# EasyEDA Pro project PM3510-AS5147P.epro

# Schematic AS5147P
Board Name: PM3510-AS5147P; Create Date: 2025-03-08; Page Name: P1; Project Name: Motor_Encoder; Schematic Name: AS5147P; Update Date: 2025-03-09
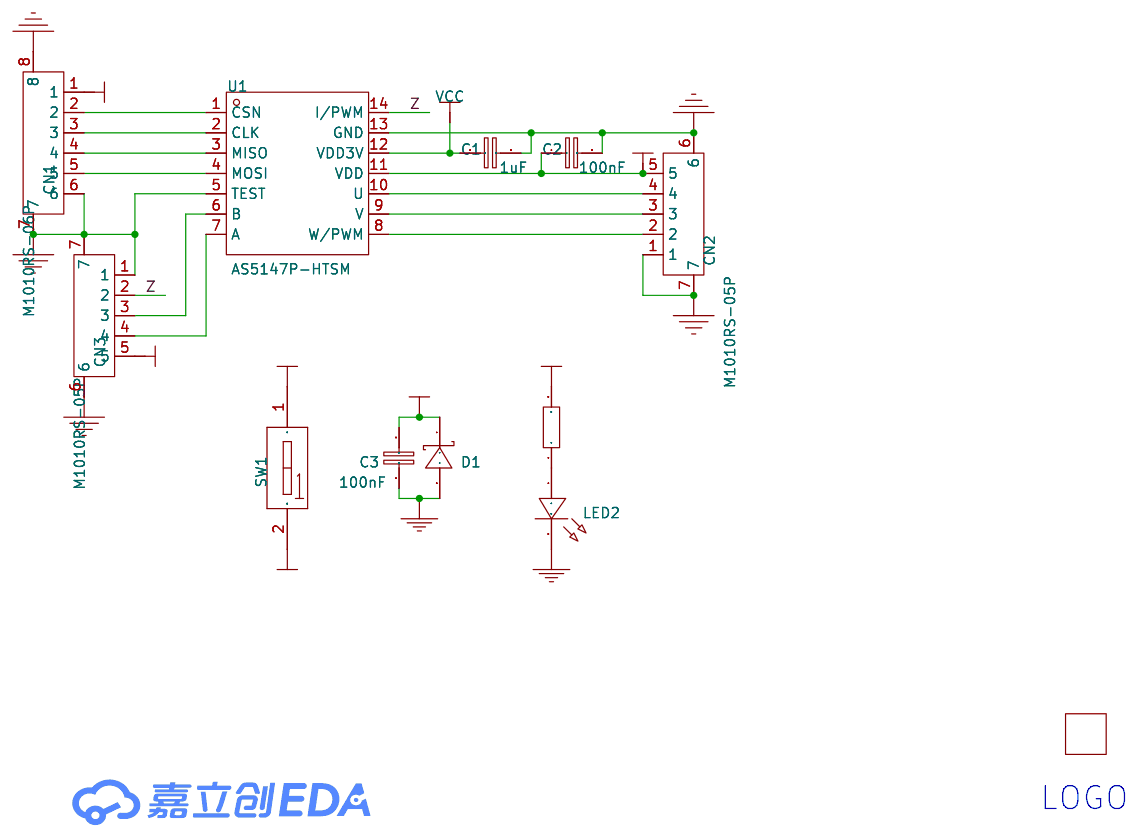
[diagram p0: schematic sheet]

## Parts
C1  1uF  [C0603]
C2  100nF  [C0603]
C3  100nF  [C0603]
CN1  M1010RS-06P  [CONN-SMD_M1010RS-06P]
CN2  M1010RS-05P  [CONN-SMD_M1010RS-05P]
CN3  M1010RS-05P  [CONN-SMD_M1010RS-05P]
D1  SMFJ5.0A  [SOD-123_L2.8-W1.8-LS3.7-RD]
H1  MoonGrt  [MoonGrt]  (no BOM)
LED2  -  [LED0603]
R2  1kΩ  [R0603]
SW1  DSHP01TSGET  [SW-SMD_DSHP01TSGET]
U1  AS5147P-HTSM  [TSSOP-14_L5.0-W4.4-P0.65-LS6.5-BL]

## Library data of the parts
C1 = CL10A105KB8NNNC: 容值:1uF;精度:±10%;额定电压:50V;材质(温度系数):X5R;; LCSC Part Name: 1uF ±10% 50V; Supplier Part: C15849; Manufacturer: SAMSUNG(三星); Supplier Footprint: 0603; JLCPCB Part Class: Basic Part; Datasheet: https://atta.szlcsc.com/upload/public/pdf/source/20160218/1457707763339.pdf; Supplier: LCSC; Tolerance: ±10%; Voltage Rated: 50V; Temperature Coefficient: X5R
C2 C3 = CC0603KRX7R9BB104: 容值:100nF;精度:±10%;额定电压:50V;材质(温度系数):X7R;; LCSC Part Name: 100nF ±10% 50V; Supplier Part: C14663; Manufacturer: YAGEO(国巨); Supplier Footprint: 0603; JLCPCB Part Class: Basic Part; Datasheet: https://atta.szlcsc.com/upload/public/pdf/source/20180910/C282072_33301C7F631E79921B82A8DAC6BCC5B3.pdf; Supplier: LCSC; Tolerance: ±10%; Voltage Rated: 50V; Temperature Coefficient: X7R
CN1 = M1010RS-06P: 插针结构:1x6P;间距:1mm;安装方式:卧贴;参考系列:-;总PIN数:6P;排数:1;每排PIN数:6;行距:-;额定电流:1A;工作温度范围:-25℃~+85℃;; LCSC Part Name: 1x6P 间距:1mm 卧贴; Supplier Part: C541848; Manufacturer: XFCN(兴飞); Supplier Footprint: SMD,P=1mm,卧贴; JLCPCB Part Class: Extended Part; Datasheet: https://atta.szlcsc.com/upload/public/pdf/source/20200518/C541847_4FBBB7CE1CCFE042AF6DD43CBAA42E89.pdf; Supplier: LCSC; Pins Structure: 1x6P; Pitch: 1mm; Mounting Style: 卧贴; Number of Pins: 6P; Number of Rows: 1; Number of PINs Per Row: 6; Current Rating (Max): 1A; Operating Temperature Range: -25℃~+85℃
CN2 CN3 = M1010RS-05P: 插针结构:1x5P;间距:1mm;安装方式:卧贴;参考系列:-;总PIN数:5P;排数:1;每排PIN数:5;行距:-;额定电流:1A;工作温度范围:-25℃~+85℃;; LCSC Part Name: 1x5P 间距:1mm 卧贴; Supplier Part: C541847; Manufacturer: XFCN(兴飞); Supplier Footprint: SMD,P=1mm,卧贴; JLCPCB Part Class: Extended Part; Datasheet: https://atta.szlcsc.com/upload/public/pdf/source/20200518/C541847_4FBBB7CE1CCFE042AF6DD43CBAA42E89.pdf; Supplier: LCSC; Pins Structure: 1x5P; Pitch: 1mm; Mounting Style: 卧贴; Number of Pins: 5P; Number of Rows: 1; Number of PINs Per Row: 5; Current Rating (Max): 1A; Operating Temperature Range: -25℃~+85℃
D1 = SMFJ5.0A_C61216: 反向截止电压(Vrwm):5V;最大钳位电压:9.2V;峰值脉冲电流(Ipp)@10/1000us:21.7A;击穿电压:6.4V;; Supplier Part: C61216; Manufacturer: RUILON(瑞隆源); Supplier Footprint: SOD-123; JLCPCB Part Class: Extended Part; Datasheet: https://atta.szlcsc.com/upload/public/pdf/source/20170601/1496285793836.pdf; Supplier: LCSC; Reverse Stand-Off Voltage (Vrwm): 5V; Maximum Clamping Voltage: 9.2V; Peak Pulse Current (Ipp)@10/1000us: 21.7A; Breakdown Voltage: 6.4V; Reverse Leakage Current (Ir): 400uA; Type: TVS
H1 = MoonGrt
LED2 = LED0603B
R2 = R0603
SW1 = DSHP01TSGET: 类型:平拨,凹槽式;电路结构:单刀单掷;开关位数:1位;使用寿命:-;颜色:黑色;; LCSC Part Name: 1位低推贴胶; Supplier Part: C126848; Manufacturer: YE; Supplier Footprint: SMD,2.9x5.4mm; JLCPCB Part Class: Extended Part; Datasheet: https://atta.szlcsc.com/upload/public/pdf/source/20220428/74B573882803886B9DF6FBBC1614692A.pdf; Supplier: LCSC; Type: 平拨,凹槽式; Circuit: 单刀单掷; Number of Positions: 1位; Color: 黑色
U1 = AS5147P-HTSM: LCSC Part Name: 磁旋转位置传感器; Supplier Part: C481876; Manufacturer: AMS; Supplier Footprint: TSSOP-14; JLCPCB Part Class: 扩展库; Datasheet: https://atta.szlcsc.com/upload/public/pdf/source/20200113/C481876_DDD4CDA1618FB643763D2AB30E250463.pdf; Supplier: LCSC

## Nets
5V: C2.1 CN1.1 CN2.5 CN3.5 SW1.2(B1) U1.11(VDD)
GND: C1.2 C2.2 C3.1 CN1.6 CN1.7 CN1.8 CN2.1 CN2.6 CN2.7 CN3.1 CN3.6 CN3.7 D1.2(A) LED2.2 U1.5(TEST) U1.13(GND)
VCC: C1.1 C3.2 D1.1(K) R2.2 SW1.1(A1) U1.12(VDD3V)
Z: CN3.2 U1.14(I/PWM)
$2N85576: CN3.3 U1.6(B)
$2N85583: CN3.4 U1.7(A)
$2N85679: CN1.5 U1.4(MOSI)
$2N85710: CN1.4 U1.3(MISO)
$2N85714: CN1.3 U1.2(CLK)
$2N85719: CN1.2 U1.1(CSN)
$2N85764: CN2.4 U1.10(U)
$2N85768: CN2.3 U1.9(V)
$2N85773: CN2.2 U1.8(W/PWM)
$2N87966: LED2.1 R2.1

## Notes on the sheet
- LOGO

# Board AS5147P
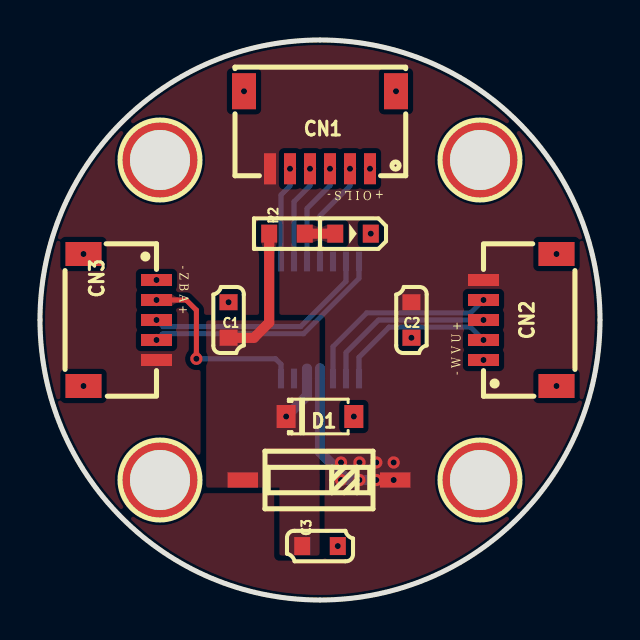
[diagram p1: board, top side]
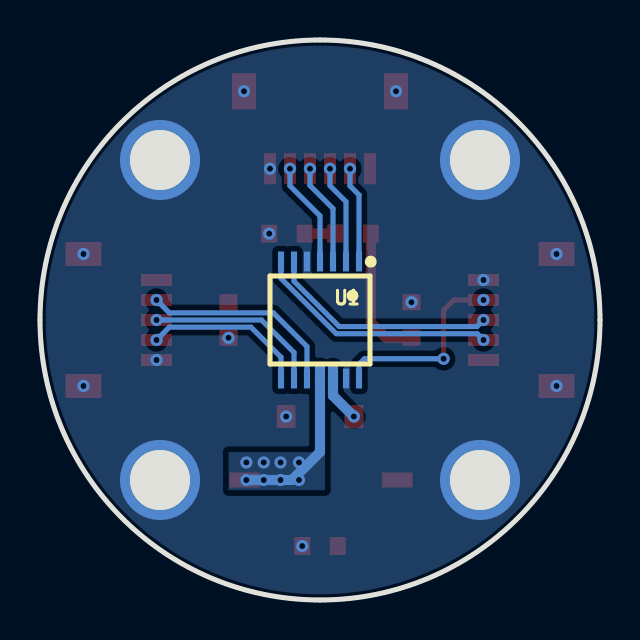
[diagram p2: board, bottom side, seen from below]

Outline 28 x 28 mm; copper layers: Top Layer, Bottom Layer. Coordinates in mm from the lower left corner of the outline.
Outline path: 0,14 arc(4.1,23.9) 14,28 arc(23.9,23.9) 28,14 arc(23.9,4.1) 14,0 arc(4.1,4.1) 0,14
Stack: Top Layer 0.0356mm / Dielectric 1 0.32mm FR-4 er 4.8 / Bottom Layer 0.0356mm

## Design rules (mm)
net C1: Sheet1
net C2: Sheet1
net C3: Sheet1
net R1: Sheet1
net G V S L I O: Sheet1
net J1: Sheet1
net J3: Sheet1
net 1: Sheet1
net J2: Inside Board Components
template: MoonGrt
spacing Default (default): track to track 0.102, other pairs 0 to 0.102
track width Default (default): min 0.102, default 0.102, max 25.4
differential pair differentialPair (default): width min 0.127, default 0.254, max 2.54; gap min 0.152, default 0.152
via Default (default): diameter min 0.508, default 0.508, max 100.025; hole min 0.305, default 0.305, max 59.995

## Placement (name value [footprint] x y rotation side)
C1  1uF  [C0603]  9.43 14 90 top
C2  100nF  [C0603]  18.57 14 270 top
C3  100nF  [C0603]  14 2.7 180 top
CN1  M1010RS-06P  [CONN-SMD_M1010RS-06P]  14 23.5 180 top
CN2  M1010RS-05P  [CONN-SMD_M1010RS-05P]  24 14 270 top
CN3  M1010RS-05P  [CONN-SMD_M1010RS-05P]  4 14 90 top
D1  SMFJ5.0A  [SOD-123_L2.8-W1.8-LS3.7-RD]  14 9.17 0 top
H1  -  [MoonGrt]  14 14 0 top
LED2  -  [LED0603]  15.65 18.32 0 top
NOREF  -  [Pad_ie15]  6 6 180 top
NOREF#2  -  [Pad_ie14]  6 22 180 top
NOREF#3  -  [Pad_ie16]  22 6 180 top
NOREF#4  -  [Pad_ie13]  22 22 180 top
R2  1kΩ  [R0603]  12.35 18.32 180 top
SW1  DSHP01TSGET  [SW-SMD_DSHP01TSGET]  13.95 6 90 top
U1  AS5147P-HTSM  [TSSOP-14_L5.0-W4.4-P0.65-LS6.5-BL]  14 14 0 bottom

## Footprints (pads in the part's own frame, mm; a bottom-side part is the same pattern mirrored in y, then rotated)
C0603
  rect 0.8x0.9 smd: 1(-0.889,0) 2(0.889,0)
CONN-SMD_M1010RS-05P
  rect 0.6x1.55 smd: 1(2,-1.825) 2(1,-1.825) 3(0,-1.825) 4(-1,-1.825) 5(-2,-1.825)
  rect 1.2x1.8 smd: 6(-3.3,1.825) 7(3.3,1.825)
CONN-SMD_M1010RS-06P
  rect 0.6x1.55 smd: 1(2.5,1.938) 2(1.5,1.938) 3(0.5,1.938) 4(-0.5,1.938) 5(-1.5,1.938) 6(-2.5,1.938)
  rect 1.2x1.8 smd: 7(-3.8,-1.938) 8(3.8,-1.938)
LED0603
  rect 0.8x0.9 smd: 1(-0.889,0) 2(0.888,0)
Pad_ie13
  round 4 hole 3: 8(0,0)
Pad_ie14
  round 4 hole 3: 7(0,0)
Pad_ie15
  round 4 hole 3: 6(0,0)
Pad_ie16
  round 4 hole 3: 5(0,0)
R0603
  rect 0.8x0.9 smd: 1(-0.889,0) 2(0.889,0)
SOD-123_L2.8-W1.8-LS3.7-RD
  rect 0.95x1.15 smd: 1(-1.692,0) 2(1.692,0)
SW-SMD_DSHP01TSGET
  rect 0.762x1.524 smd: 1(0,3.81) 2(0,-3.81)
TSSOP-14_L5.0-W4.4-P0.65-LS6.5-BL
  rect 0.305x0.991 smd: 1(-1.95,-2.925) 2(-1.3,-2.925) 3(-0.65,-2.925) 4(0,-2.925) 5(0.65,-2.925) 6(1.3,-2.925) 7(1.95,-2.925) 8(1.95,2.925) 9(1.3,2.925) 10(0.65,2.925) 11(0,2.925) 12(-0.65,2.925) 13(-1.3,2.925) 14(-1.95,2.925)

## Nets
As in the schematic, except:
GND: C1.2 C2.2 C3.1 CN1.6 CN1.7 CN1.8 CN2.1 CN2.6 CN2.7 CN3.1 CN3.6 CN3.7 D1.2 LED2.2 NOREF.6 NOREF#2.7 NOREF#3.5 NOREF#4.8 U1.5 U1.13

## Via types
v1: diameter 0.61, hole 0.305, Top Layer to Bottom Layer, 34 vias

## Routing (per net, layer and track width the routed paths; a pad name or vN(x,y) marks a point on that pad's centre or on a via; arc(x,y) is an arc through that point)
5V: length 8.5
  Bottom Layer w0.508: v1(17.68,6) v1(16.81,6) v1(15.97,6) 15.4,6 14,7.4 U1.11 14,11.59
  vias: v1(15.05,6.88) v1(15.05,6) v1(15.97,6.88) v1(16.81,6.88) v1(17.68,6.88)
GND:
  vias: v1(2.18,17.3) v1(2.18,10.7) v1(5.82,16) v1(9.43,14.89) v1(10.2,25.44) v1(14.89,2.7) v1(15.69,9.17) v1(16.5,21.56) v1(16.54,18.32) v1(17.8,25.44) v1(18.57,13.11) v1(22.18,12) v1(25.82,17.3) v1(25.82,10.7)
VCC: length 9.6
  Top Layer w0.508: C1.1 10.7,13.11 11.46,13.87 R2.2
  Bottom Layer w0.508: v1(12.31,9.17) 13.35,10.22 U1.12 13.35,11.57
Z: length 9.7
  Top Layer w0.254: v1(5.82,15) 7.31,15 7.82,14.49 v1(7.82,12.06)
  Bottom Layer w0.254: U1.14 12.05,11.79 11.78,12.06 v1(7.82,12.06)
$2N85576: length 11.5
  Bottom Layer w0.254: U1.6 15.3,15.94 13.03,13.67 6.16,13.67 v1(5.82,14)
$2N85583: length 12.2
  Bottom Layer w0.254: U1.7 15.95,16.08 13.18,13.31 6.14,13.31 v1(5.82,13)
$2N85679: length 5.3
  Bottom Layer w0.254: U1.4 14,19.21 15.5,20.71 v1(15.5,21.56)
$2N85710: length 5.1
  Bottom Layer w0.254: v1(14.5,21.56) 14.5,20.72 13.35,19.57 U1.3
$2N85714: length 5
  Bottom Layer w0.254: v1(13.5,21.56) 13.5,20.71 12.7,19.91 U1.2
$2N85719: length 4.8
  Bottom Layer w0.254: U1.1 12.05,20.25 12.5,20.7 v1(12.5,21.56)
$2N85764: length 10.1
  Bottom Layer w0.254: v1(22.18,15) 21.53,14.36 16.33,14.36 14.65,12.67 U1.10
$2N85768: length 8.8
  Bottom Layer w0.254: v1(22.18,14) 16.93,14 15.3,12.38 U1.9
$2N85773: length 8.2
  Bottom Layer w0.254: U1.8 15.95,12.14 17.45,13.64 21.53,13.64 v1(22.18,13)
$2N87966: length 1.5
  Top Layer w0.508: R2.1 LED2.1

## Copper pours and planes (outline as drawn; the poured copper is in the pictures)
5V on Top Layer: 4.1,4.35 0,14.25 4.1,24.15 14,28.25 23.9,24.15 28,14.25 23.9,4.35 14,0.25
5V on Top Layer: 28,14.37 27.96,15.1 27.88,15.83 27.77,16.55 27.61,17.27 27.42,17.98 27.2,18.67 26.93,19.36 26.64,20.03 26.3,20.68 25.94,21.31 25.54,21.93 25.11,22.52 24.65,23.09 24.16,23.64 23.64,24.16 23.09,24.65 22.52,25.11 21.93,25.54 21.31,25.94 20.68,26.3 20.03,26.64 19.36,26.93 18.67,27.2 17.98,27.42 17.27,27.61 16.55,27.77 15.83,27.88 15.1,27.96 14.37,28 13.63,28 12.9,27.96 12.17,27.88 11.45,27.77 10.73,27.61 10.02,27.42 9.33,27.2 8.64,26.93 7.97,26.64 7.32,26.3 6.69,25.94 6.07,25.54 5.48,25.11 4.91,24.65 4.36,24.16 3.84,23.64 3.35,23.09 2.89,22.52 2.46,21.93 2.06,21.31 1.7,20.68 1.36,20.03 1.07,19.36 0.8,18.67 0.58,17.98 0.39,17.27 0.23,16.55 0.12,15.83 0.04,15.1 0,14.37 0,13.63 0.04,12.9 0.12,12.17 0.23,11.45 0.39,10.73 0.58,10.02 0.8,9.33 1.07,8.64 1.36,7.97 1.7,7.32 2.06,6.69 2.46,6.07 2.89,5.48 3.35,4.91 3.84,4.36 4.36,3.84 4.91,3.35 5.48,2.89 6.07,2.46 6.69,2.06 7.32,1.7 7.97,1.36 8.64,1.07 9.33,0.8 10.02,0.58 10.73,0.39 11.45,0.23 12.17,0.12 12.9,0.04 13.63,0 14.37,0 15.1,0.04 15.83,0.12 16.55,0.23 17.27,0.39 17.98,0.58 18.67,0.8 19.36,1.07 20.03,1.36 20.68,1.7 21.31,2.06 21.93,2.46 22.52,2.89 23.09,3.35 23.64,3.84 24.16,4.36 24.65,4.91 25.11,5.48 25.54,6.07 25.94,6.69 26.3,7.32 26.64,7.97 26.93,8.64 27.2,9.33 27.42,10.02 27.61,10.73 27.77,11.45 27.88,12.17 27.96,12.9 28,13.63
5V on Bottom Layer: 13.75,7.4 18.57,7.4 18.57,5.49 13.75,5.49
GND on Bottom Layer: 28,14.37 27.96,15.1 27.88,15.83 27.77,16.55 27.61,17.27 27.42,17.98 27.2,18.67 26.93,19.36 26.64,20.03 26.3,20.68 25.94,21.31 25.54,21.93 25.11,22.52 24.65,23.09 24.16,23.64 23.64,24.16 23.09,24.65 22.52,25.11 21.93,25.54 21.31,25.94 20.68,26.3 20.03,26.64 19.36,26.93 18.67,27.2 17.98,27.42 17.27,27.61 16.55,27.77 15.83,27.88 15.1,27.96 14.37,28 13.63,28 12.9,27.96 12.17,27.88 11.45,27.77 10.73,27.61 10.02,27.42 9.33,27.2 8.64,26.93 7.97,26.64 7.32,26.3 6.69,25.94 6.07,25.54 5.48,25.11 4.91,24.65 4.36,24.16 3.84,23.64 3.35,23.09 2.89,22.52 2.46,21.93 2.06,21.31 1.7,20.68 1.36,20.03 1.07,19.36 0.8,18.67 0.58,17.98 0.39,17.27 0.23,16.55 0.12,15.83 0.04,15.1 0,14.37 0,13.63 0.04,12.9 0.12,12.17 0.23,11.45 0.39,10.73 0.58,10.02 0.8,9.33 1.07,8.64 1.36,7.97 1.7,7.32 2.06,6.69 2.46,6.07 2.89,5.48 3.35,4.91 3.84,4.36 4.36,3.84 4.91,3.35 5.48,2.89 6.07,2.46 6.69,2.06 7.32,1.7 7.97,1.36 8.64,1.07 9.33,0.8 10.02,0.58 10.73,0.39 11.45,0.23 12.17,0.12 12.9,0.04 13.63,0 14.37,0 15.1,0.04 15.83,0.12 16.55,0.23 17.27,0.39 17.98,0.58 18.67,0.8 19.36,1.07 20.03,1.36 20.68,1.7 21.31,2.06 21.93,2.46 22.52,2.89 23.09,3.35 23.64,3.84 24.16,4.36 24.65,4.91 25.11,5.48 25.54,6.07 25.94,6.69 26.3,7.32 26.64,7.97 26.93,8.64 27.2,9.33 27.42,10.02 27.61,10.73 27.77,11.45 27.88,12.17 27.96,12.9 28,13.63
VCC on Top Layer: 11.97,6.38 13.97,6.38 13.97,2.22 11.97,2.22
VCC on Top Layer: 8.28,14 14,14 14,5.59 8.28,5.59

Small or netless copper shapes (teardrops, artwork), in the pictures only: 7 on Top Layer, 27 on Bottom Layer

## Text on the board
Top Silkscreen Layer: + O I L S - | - Z B A + | - W V U +
